# Altium schematic sheet Power V12P0.SchDoc: 12.0 V Regulator
size Tabloid; Date: 8/14/2017; ApprovedBy: NA; CompanyName: Cospan Design LLC; DrawnBy: Dave McCoy; Engineer: Dave McCoy; DocumentNumber: 19; Revision: A; SheetNumber: 19; SheetTotal: 20; Client: Public; Project: Enigma; ProjectPrettyName: Enigma
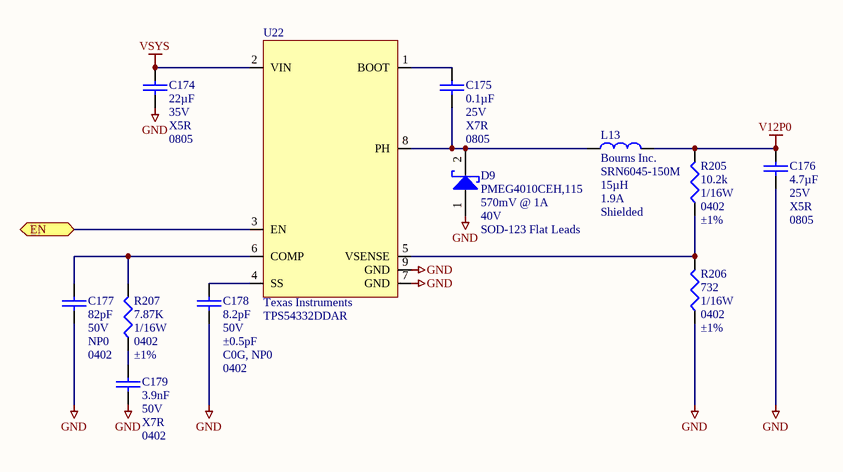
[diagram p0: Power V12P0.SchDoc]

## Parts
C174  Capacitance: 22µF  Voltage - Rated: 35V  Temperature Coefficient: X5R  Package / Case: 0805  [C_ERA-0805]  (hidden comment: C_0805_22µF_35V)
C175  Capacitance: 0.1µF  Voltage - Rated: 25V  Temperature Coefficient: X7R  Package / Case: 0805  [C_ERA-0805]  (hidden comment: 0.1uF)
C176  Voltage - Rated: 25V  Temperature Coefficient: X5R  Package / Case: 0805  [C_ERA-0805]  (hidden comment: 4.7µF)
C177  Voltage - Rated: 50V  Temperature Coefficient: NP0  Package / Case: 0402  [C_ERA-0402]  (hidden comment: 82pF)
C178  Voltage - Rated: 50V  Tolerance: ±0.5pF  Temperature Coefficient: C0G, NP0  Package / Case: 0402  [C_ERA-0402]  (hidden comment: 8.2pF)
C179  Capacitance: 3.9nF  Voltage - Rated: 50V  Temperature Coefficient: X7R  Package / Case: 0402  [C_0402]  (hidden comment: C_0402_3.9nF)
D9  Manufacturer Part Number: PMEG4010CEH,115  Voltage - Forward (Vf) (Max) @ If: 570mV @ 1A  Voltage - DC Reverse (Vr) (Max): 40V  Package / Case: SOD-123 Flat Leads  [D_SOD123F]  (hidden comment: D_SCHOTT_PMEG4010CEH)
L13  Manufacturer: Bourns Inc.  Manufacturer Part Number: SRN6045-150M  Inductance: 15µH  Current Rating: 1.9A  Shielding: Shielded  [SRN6045]  (hidden comment: L_SRN6045-150M)
R205  Resistance In Ohms: 10.2k  Power (Watts): 1/16W  Case: 0402  Tolerance: ±1%  [R_0402]  (hidden comment: R_0402_10.2k)
R206  Resistance In Ohms: 732  Power (Watts): 1/16W  Case: 0402  Tolerance: ±1%  [R_0402]  (hidden comment: R_0402_732)
R207  Resistance In Ohms: 7.87K  Power (Watts): 1/16W  Case: 0402  Tolerance: ±1%  [R_0402]  (hidden comment: R_0402_7.87K)
U22  Manufacturer: Texas Instruments  Manufacturer Part Number: TPS54332DDAR  [DDA0008H]  (hidden comment: U_TPS54332DDAR)

## Ports
EN

## Nets
GND: C174.1 C176.1 C177.1 C178.1 C179.1 D9.1(A) R206.2 U22.7(GND) U22.9(GND)
V12P0: C176.2 L13.1 R205.1
VSYS: C174.2 U22.2(VIN)
EN: U22.3(EN) ; port EN
NetC175_1: C175.1 D9.2(K) L13.2 U22.8(PH)
NetC175_2: C175.2 U22.1(BOOT)
NetC177_2: C177.2 R207.1 U22.6(COMP)
NetC178_2: C178.2 U22.4(SS)
NetC179_2: C179.2 R207.2
NetR205_2: R205.2 R206.1 U22.5(VSENSE)

## Library data of the parts
C174 = C_0805_22µF_35V: CAP CER 22UF 35V X5R 0805; Manufacturer: TDK Corporation; Manufacturer Part Number: C2012X5R1V226M125AC; Tolerance: ±20%; Supplier 1: Digi-Key; RoHS: RoHS Compliant; Category: Capacitors; Stock 1: 3681; Pricing 1: 1=1.14, 10=0.863, 100=0.6176, 500=0.47818, 1000=0.41176 (USD); Packaging: Cut Tape (CT); Mounting Type: Surface Mount, MLCC; Operating Temperature: -55°C ~ 85°C; Applications: General Purpose; Ratings: -; Size / Dimension: 0.079" L x 0.049" W (2.00mm x 1.25mm); Height - Seated (Max): -; Thickness (Max): 0.057" (1.45mm); Lead Spacing: -; Features: Low ESL; Lead Style: -; ComponentLink1URL: https://product.tdk.com/info/en/catalog/datasheets/mlcc_commercial_general_en.pdf; ComponentLink1Description: https://product.tdk.com/info/en/catalog/datasheets/mlcc_commercial_general_en.pdf; Supplier Part Number 1: 445-14428-1-ND; Part Status: Active; Failure Rate: -
C175 = C_0805_0.1uF_25V: CAP CER 1UF 50V X7R 0805; Manufacturer: AVX Corporation; Manufacturer Part Number: 08053C104KAT2A; Tolerance: ±10%; Supplier 1: Digi-Key; Supplier Part Number 1: 478-3755-1-ND; RoHS: RoHS Compliant; Category: Capacitors; Stock 1: 294368; Pricing: 1=0.22, 10=0.138, 100=0.0495, 250=0.03576, 500=0.0264, 1000=0.01788 (USD); Mounting Type: Surface Mount, MLCC; Operating Temperature: -55°C ~ 125°C; Applications: General Purpose; Ratings: -; Size / Dimension: 0.079" L x 0.049" W (2.01mm x 1.25mm); Height - Seated (Max): -; Thickness (Max): 0.037" (0.94mm); Lead Spacing: -; Features: -; Packaging: Cut Tape (CT); Lead Style: -; ComponentLink1URL: http://www.avx.com/docs/Catalogs/cx7r.pdf; ComponentLink1Description: http://www.avx.com/docs/Catalogs/cx7r.pdf
C176 = C_0805_4.7µF_25V: CAP CER 4.7UF 25V 10% X5R 0805; Manufacturer: Taiyo Yuden; Manufacturer Part Number: TMK212BJ475KG-T; Supplier 1: Digi-Key; RoHS: RoHS Compliant; Category: Capacitors; Stock 1: 38955; Pricing 1: 1=0.24, 10=0.2, 50=0.1126, 100=0.1, 250=0.075, 500=0.06626, 1000=0.05875 (USD); Tolerance: ±10%; Mounting Type: Surface Mount, MLCC; Operating Temperature: -55°C ~ 85°C; Applications: General Purpose; Ratings: -; Size / Dimension: 0.079" L x 0.049" W (2.00mm x 1.25mm); Height - Seated (Max): -; Thickness (Max): 0.053" (1.35mm); Lead Spacing: -; Features: -; Packaging: Cut Tape (CT); Lead Style: -; ComponentLink1URL: http://www.yuden.co.jp/productdata/catalog/en/mlcc01_e.pdf; ComponentLink1Description: http://www.yuden.co.jp/productdata/catalog/en/mlcc01_e.pdf; Supplier Part Number 1: 587-1782-1-ND; Capacitance: 4.7µF
C177 = C_0402_82PF_50V: CAP CER 82PF 50V 5% C0G 0402; Manufacturer: Murata Electronics North America; Manufacturer Part Number: GRM1555C1H820FA01D; Tolerance: ±1%; Description: CAP CER 82PF 50V C0G/NP0 0402; Supplier 1: Digi-Key; Supplier Part Number 1: 490-8228-1-ND; RoHS: RoHS Compliant; Category: Capacitors; Stock 1: 248442; Mounting Type: Surface Mount, MLCC; Operating Temperature: -55°C ~ 125°C; Applications: General Purpose; Ratings: -; Size / Dimension: 0.039" L x 0.020" W (1.00mm x 0.50mm); Lead Spacing: -; Features: -; Packaging: Cut Tape (CT); Lead Style: -; ComponentLink1URL: http://search.murata.co.jp/Ceramy/image/img/A01X/G101/ENG/GRM1555C1H820FA01-01.pdf; ComponentLink1Description: http://search.murata.co.jp/Ceramy/image/img/A01X/G101/ENG/GRM1555C1H820FA01-01.pdf; Capacitance: 82pF; Pricing 1: 1=0.1, 10=0.061, 100=0.0273, 500=0.01948, 1000=0.01531, 2500=0.01392, 5000=0.0128 (USD); Part Status: Active; Height - Seated (Max): -; Thickness (Max): 0.022" (0.55mm)
C178 = C_0402_8.2PF_50V: CAP CER 8.2PF 50V NP0 0402; Manufacturer: Yageo; Manufacturer Part Number: CC0402DRNPO9BN8R2; Description: CAP CER 8.2PF 50V C0G/NPO 0402; Supplier 1: Digi-Key; Supplier Part Number 1: 311-1012-1-ND; RoHS: RoHS Compliant; Category: Capacitors; Stock 1: 98543; Mounting Type: Surface Mount, MLCC; Operating Temperature: -55°C ~ 125°C; Applications: General Purpose; Ratings: -; Size / Dimension: 0.039" L x 0.020" W (1.00mm x 0.50mm); Height - Seated (Max): -; Thickness (Max): 0.022" (0.55mm); Lead Spacing: -; Features: -; Packaging: Cut Tape (CT); Lead Style: -; ComponentLink1URL: http://www.yageo.com/documents/recent/UPY-GP_NP0_16V-to-50V_16.pdf; ComponentLink1Description: http://www.yageo.com/documents/recent/UPY-GP_NP0_16V-to-50V_16.pdf; Capacitance: 8.2pF; Pricing 1: 1=0.1, 10=0.029, 100=0.0128, 500=0.00914, 1000=0.00718, 2500=0.00653, 5000=0.006 (USD); Part Status: Active; Failure Rate: -
C179 = C_0402_3.9nF: CAP CER 3900PF 50V X7R 0402; Manufacturer: Murata Electronics North America; Manufacturer Part Number: GRM155R71H392KA01D; Tolerance: ±10%; Supplier 1: Digi-Key; RoHS: RoHS Compliant; Category: Capacitors; Stock 1: 264193; Pricing 1: 1=0.1, 10=0.026, 100=0.0118, 500=0.00844, 1000=0.00662, 2500=0.00602, 5000=0.00554 (USD); Packaging: Cut Tape (CT); Part Status: Active; Operating Temperature: -55°C ~ 125°C; Features: -; Ratings: -; Applications: General Purpose; Mounting Type: Surface Mount, MLCC; Size / Dimension: 0.039" L x 0.020" W (1.00mm x 0.50mm); Height - Seated (Max): -; Thickness (Max): 0.022" (0.55mm); Lead Spacing: -; Lead Style: -; ComponentLink1URL: http://www.murata.com/~/media/webrenewal/support/library/catalog/products/capacitor/mlcc/c02e.ashx; ComponentLink1Description: http://www.murata.com/~/media/webrenewal/support/library/catalog/products/capacitor/mlcc/c02e.ashx; Supplier Part Number 1: 490-1307-1-ND
D9 = D_SCHOTT_PMEG4010CEH: SCHOTTKY RECT 40V 1A SOD123F; Manufacturer: Vishay Semiconductor Diodes Division; Speed: Fast Recovery =< 500ns, > 200mA (Io); Current - Reverse Leakage @ Vr: 500µA @ 40V; Capacitance @ Vr, F: 38pF @ 10V, 1MHz; Supplier 1: Digi-Key; RoHS: RoHS Compliant; Category: Discrete Semiconductor Products; Stock 1: 11879; Pricing 1: 1=0.46, 10=0.371, 25=0.3396, 100=0.2528, 250=0.22912, 500=0.1896, 1000=0.1422, 2500=0.13035 (USD); Packaging: Cut Tape (CT); Part Status: Active; Diode Type: Schottky; Current - Average Rectified (Io): 1A; Reverse Recovery Time (trr): -; Mounting Type: Surface Mount; Supplier Device Package: SMA; Operating Temperature - Junction: -55°C ~ 150°C; ComponentLink1URL: http://www.vishay.com/docs/94301/vs-mbra140trpbf.pdf; ComponentLink1Description: http://www.vishay.com/docs/94301/vs-mbra140trpbf.pdf; Supplier Part Number 1: VS-MBRA140TRPBFCT-ND
L13 = L_SRN6045-150M: FIXED IND 15UH 1.9A 95.8 MOHM; Vendor: Bourns; Type: DEV; Material - Core: Ferrite; Tolerance: ±20%; Current - Saturation: 2.3A; DC Resistance (DCR): 95.8 mOhm Max; Q @ Freq: 17 @ 2.52MHz; Frequency - Self Resonant: 13MHz; Frequency - Test: 100kHz; Datasheet URL: http://www.bourns.com/data/global/pdfs/SRN6045.pdf; Manufacturer_Part_Number: SRN6045-150M; Manufacturer_Name: Bourns; RefDes: RefDes; Value: Value; Supplier 1: Digi-Key; RoHS: RoHS Compliant; Category: Inductors, Coils, Chokes; Stock 1: 3119; Pricing 1: 1=0.43, 10=0.384, 25=0.36, 50=0.312, 100=0.288, 250=0.2736, 500=0.2496 (USD); Packaging: Cut Tape (CT); Part Status: Active; Ratings: -; Operating Temperature: -40°C ~ 125°C; Mounting Type: Surface Mount; Package / Case: Nonstandard; Size / Dimension: 0.236" L x 0.236" W (6.00mm x 6.00mm); Height - Seated (Max): 0.177" (4.50mm); ComponentLink1URL: http://www.bourns.com/docs/Product-Datasheets/SRN6045.pdf; ComponentLink1Description: http://www.bourns.com/docs/Product-Datasheets/SRN6045.pdf; Supplier Part Number 1: SRN6045-150MCT-ND
R205 = R_0402_10.2k: RES SMD 10.2K OHM 1% 1/16W 0402; Manufacturer: Stackpole Electronics Inc.; Manufacturer Part Number: RMCF0402FT10K2; Temperature Coefficient: ±100ppm/°C; Supplier 1: Digi-Key; RoHS: RoHS Compliant; Category: Resistors; Stock 1: 69477; Pricing 1: 1=0.1, 10=0.019, 50=0.0106, 100=0.0078, 250=0.00596, 500=0.00476, 1000=0.0035, 2500=0.00304, 5000=0.00251 (USD); Packaging: Cut Tape (CT); Resistance (Ohms): 10.2k; Composition: Thick Film; Features: Automotive AEC-Q200; Operating Temperature: -55°C ~ 155°C; Package / Case: 0402 (1005 Metric); Supplier Device Package: 0402; Size / Dimension: 0.039" L x 0.020" W (1.00mm x 0.50mm); Height: 0.016" (0.40mm); Number of Terminations: 2; ComponentLink1URL: http://www.seielect.com/Catalog/SEI-RMCF_RMCP.pdf; ComponentLink1Description: http://www.seielect.com/Catalog/SEI-RMCF_RMCP.pdf; Supplier Part Number 1: RMCF0402FT10K2CT-ND
R206 = R_0402_732: RES SMD 732 OHM 1% 1/16W 0402; Manufacturer: Yageo; Manufacturer Part Number: RC0402FR-07732RL; Temperature Coefficient: ±100ppm/°C; Supplier 1: Digi-Key; RoHS: RoHS Compliant; Category: Resistors; Stock 1: 21970; Pricing 1: 1=0.1, 10=0.014, 100=0.0055, 1000=0.00247, 2500=0.00214, 5000=0.00177 (USD); Packaging: Cut Tape (CT); Part Status: Active; Composition: Thick Film; Features: Moisture Resistant; Operating Temperature: -55°C ~ 155°C; Package / Case: 0402 (1005 Metric); Supplier Device Package: 0402; Size / Dimension: 0.039" L x 0.020" W (1.00mm x 0.50mm); Height - Seated (Max): 0.016" (0.40mm); Failure Rate: -; ComponentLink1URL: http://www.yageo.com/documents/recent/PYu-RC_Group_51_RoHS_L_7.pdf; ComponentLink1Description: http://www.yageo.com/documents/recent/PYu-RC_Group_51_RoHS_L_7.pdf; Supplier Part Number 1: YAG3225CT-ND
R207 = R_0402_7.87K: RES 7.87K OHM 1/16W 1% 0402 SMD; Manufacturer: Yageo; Manufacturer Part Number: RC0402FR-077K87L; Temperature Coefficient: ±100ppm/°C; Supplier 1: Digi-Key; Supplier Part Number 1: 311-7.87KLRCT-ND; RoHS: RoHS Compliant; Category: Resistors; Stock 1: 36940; Pricing: 10=0.014, 50=0.0104, 100=0.0079, 250=0.00584, 500=0.00432, 1000=0.00288 (USD); Resistance (Ohms): 7.87K; Composition: Thick Film; Features: -; Size / Dimension: 0.039" L x 0.020" W (1.00mm x 0.50mm); Height: 0.016" (0.40mm); Number of Terminations: 2; Packaging: Cut Tape (CT); Package / Case: 0402 (1005 Metric); ComponentLink1URL: http://www.yageo.com/documents/recent/PYu-RC0402_51_RoHS_L_6.pdf; ComponentLink1Description: http://www.yageo.com/documents/recent/PYu-RC0402_51_RoHS_L_6.pdf
U22 = U_TPS54332DDAR: IC REG BUCK ADJ 3.5A 8SOPWRPAD; Imax: 3.5; Function: Step-Down; Output Configuration: Positive; Output Type: Adjustable; Number of Outputs: 1; Voltage - Input (Min): 3.5V; Voltage - Input (Max): 28V; Voltage - Output (Min/Fixed): 0.8V; Voltage - Output (Max): 26.04V; Frequency - Switching: 1MHz; Synchronous Rectifier: No; Package: DDA0008H; Mktg_Package: DDA0008H; NSID: TPS54332DDAR; Vendor: Texas Instruments; RefDes: RefDes; Type: DEV; Value: Value; Supplier 1: Digi-Key; RoHS: RoHS Compliant; Category: Integrated Circuits (ICs); Stock 1: 8614; Pricing 1: 1=1.78, 10=1.597, 100=1.2812, 500=1.053, 1000=0.73125 (USD); Packaging: Cut Tape (CT); Part Status: Active; Topology: Buck; Current - Output: 3.5A; Operating Temperature: -40°C ~ 150°C (TJ); Mounting Type: Surface Mount; Package / Case: 8-PowerSOIC (0.154", 3.90mm Width); Supplier Device Package: 8-SO PowerPad; ComponentLink1URL: http://www.ti.com/lit/ds/symlink/tps54332.pdf; ComponentLink1Description: http://www.ti.com/lit/ds/symlink/tps54332.pdf; Supplier Part Number 1: 296-39420-1-ND